# Altium schematic sheet TIDA-010954-Input.SchDoc
size 431 x 279 mm; Date: Not shown in title block; ApprovedBy: Not shown in title block; CheckedBy: Not shown in title block; Author: Not shown in title block; CompanyName: Not shown in title block; Engineer: Not shown in title block; Organization: Not shown in title block; Address1: Not shown in title block; Address2: Not shown in title block; Address3: Not shown in title block; Address4: Not shown in title block; DocumentNumber: 2; Revision: Use project parameter SCH_Rev; SheetNumber: 5; SheetTotal: 9; PageSetup: Record=PageOptions|CenterHorizontal=True|CenterVertical=True|PrintScale=1.00|XCorrection=1.00|YCorrection=1.00|PrintKind=0|BorderSize=5000000|LeftOffset=0|BottomOffset=0|Orientation=2|PaperLength=1000|PaperWidth=1000|Scale=100|PaperSource=15|PrintQuality=600|MediaType=1|DitherType=10|PaperKind=Letter|PrintScaleMode=1; CurrentTime: Not shown in title block; CurrentDate: Not shown in title block; Time: Not shown in title block; DocumentFullPathAndName: Not shown in title block; DocumentName: Not shown in title block; ModifiedDate: 1/25/2022; ImagePath: Not shown in title block
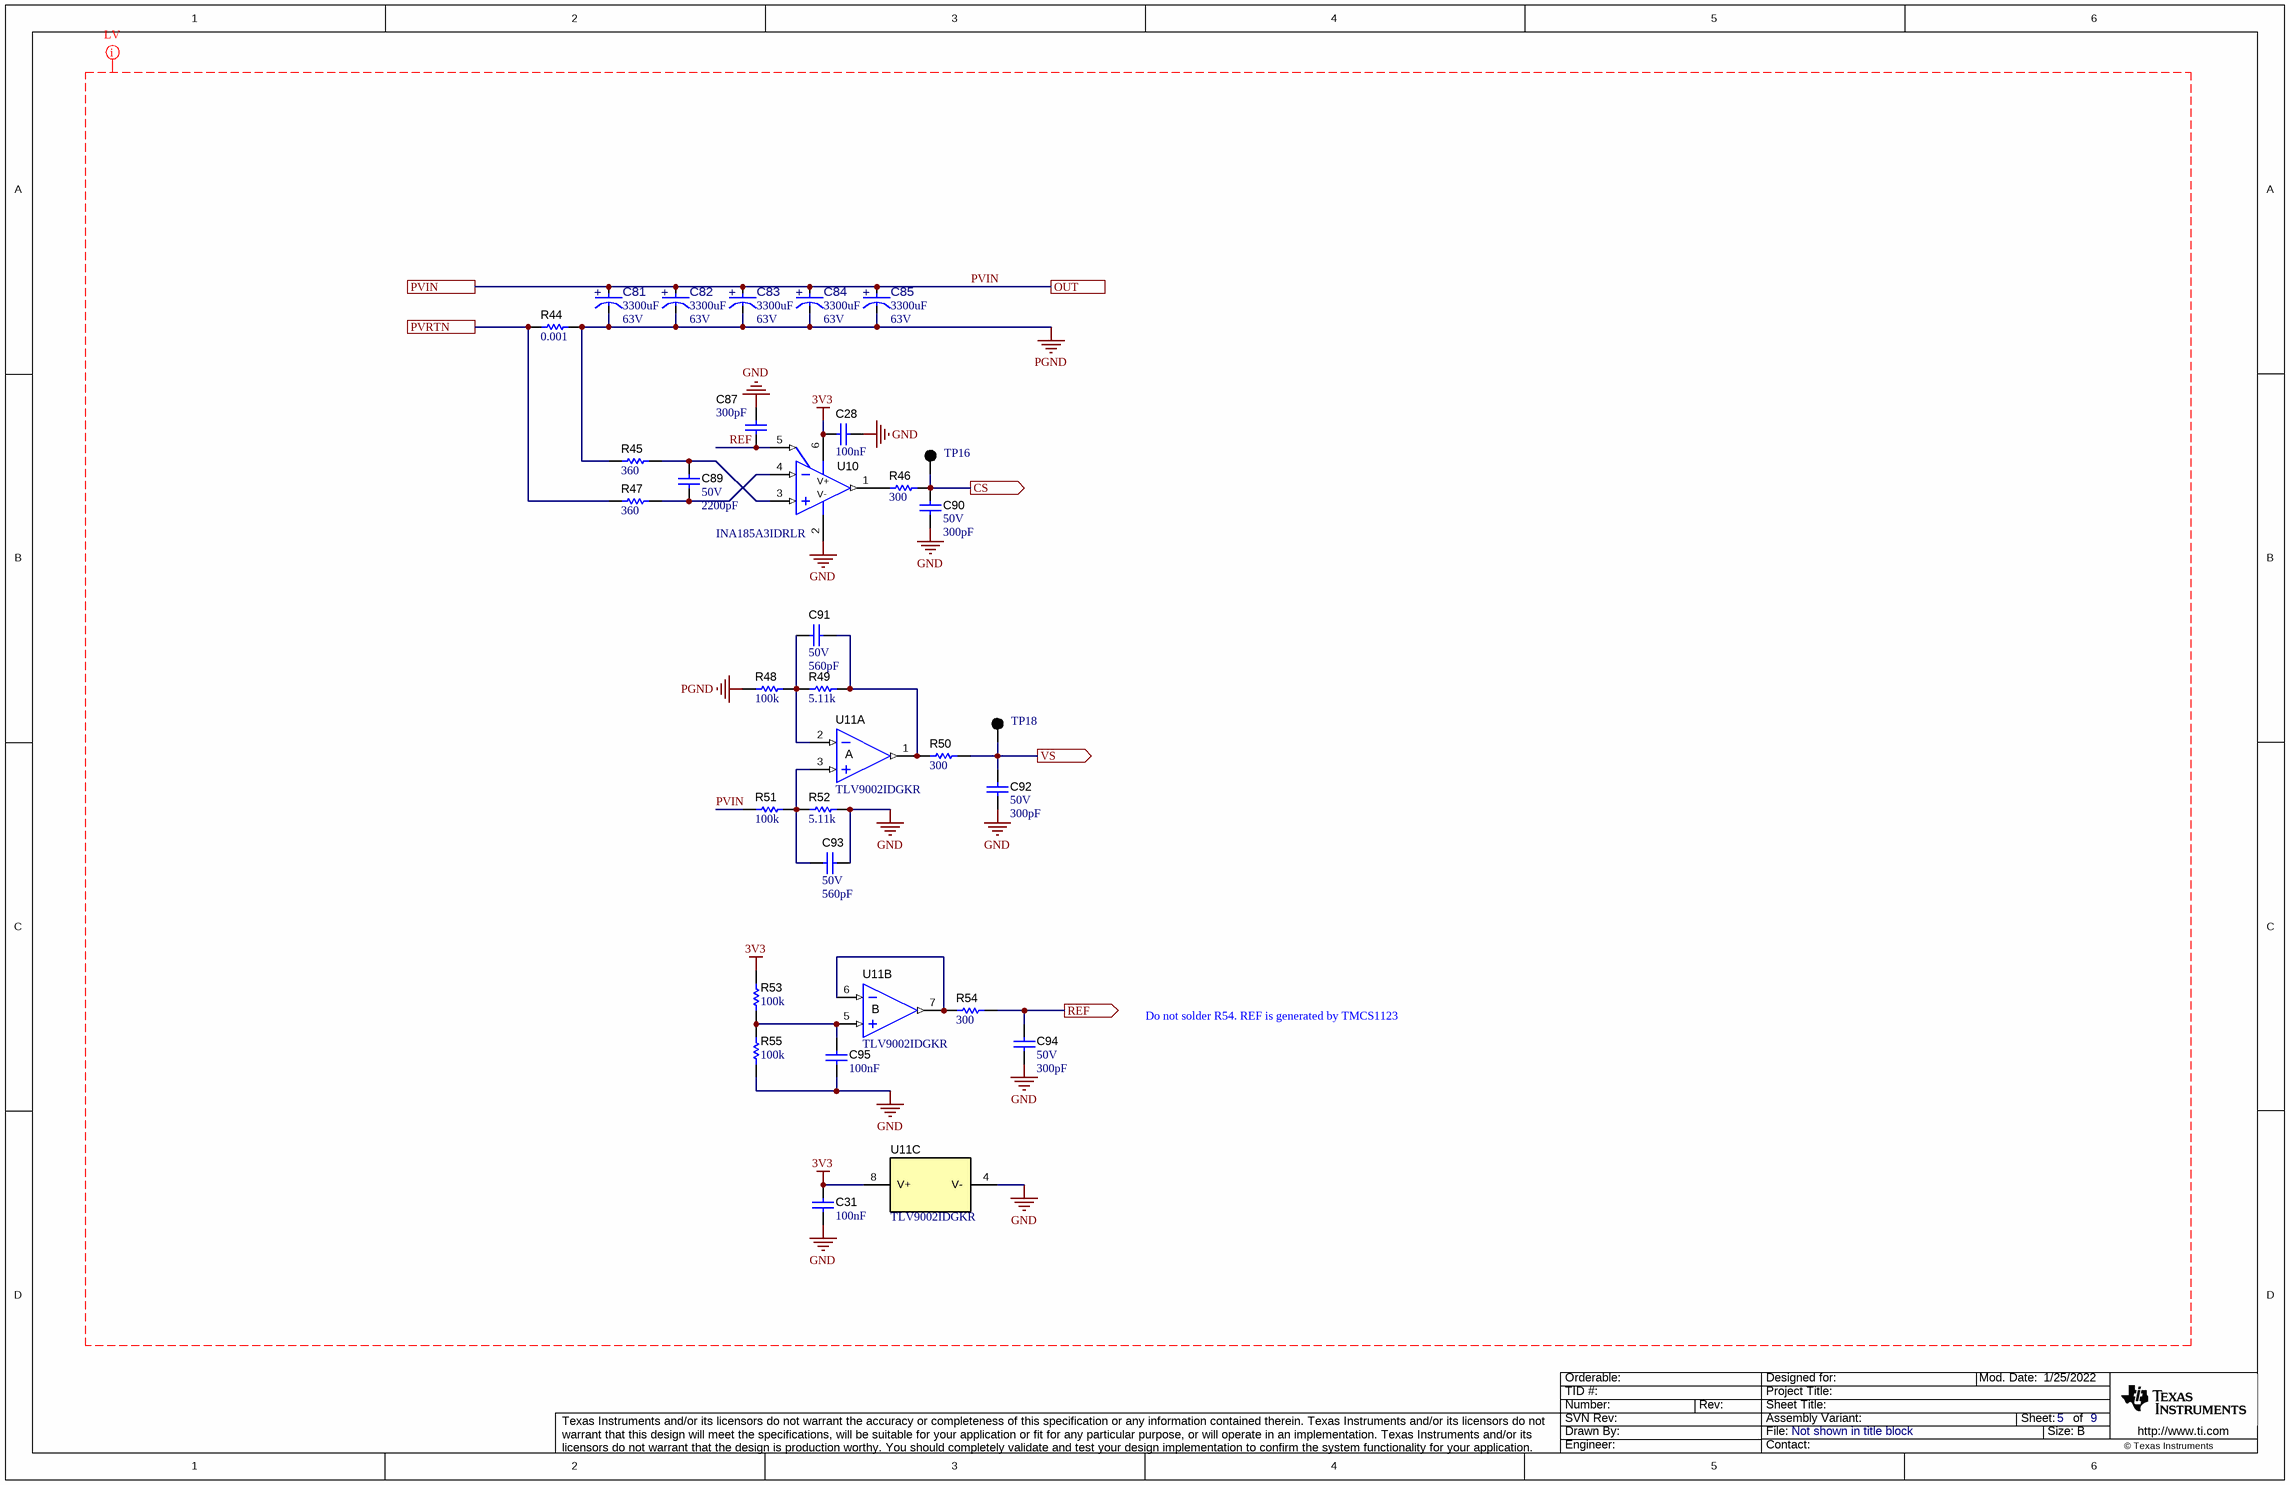
[diagram p0: TIDA-010954-Input.SchDoc]

## Parts
C28  Cap_F: 100nF  [0603]  (hidden comment: CGA3E2X7R1E104K080AA)
C31  Cap_F: 100nF  [0603]  (hidden comment: CGA3E2X7R1E104K080AA)
C81  ValueDisplayed: 3300uF  VDC_V: 63V  [FP-63ZLJ2700M18X40_RADIAL-MFG]  (hidden comment: 63ZLJ2700M18X40)
C82  ValueDisplayed: 3300uF  VDC_V: 63V  [FP-63ZLJ2700M18X40_RADIAL-MFG]  (hidden comment: 63ZLJ2700M18X40)
C83  ValueDisplayed: 3300uF  VDC_V: 63V  [FP-63ZLJ2700M18X40_RADIAL-MFG]  (hidden comment: 63ZLJ2700M18X40)
C84  ValueDisplayed: 3300uF  VDC_V: 63V  [FP-63ZLJ2700M18X40_RADIAL-MFG]  (hidden comment: 63ZLJ2700M18X40)
C85  ValueDisplayed: 3300uF  VDC_V: 63V  [FP-63ZLJ2700M18X40_RADIAL-MFG]  (hidden comment: 63ZLJ2700M18X40)
C87  ValueDisplayed: 300pF  [0603]  (hidden comment: GRM1885C1H301JA01D)
C89  VDC_V: 50V  ValueDisplayed: 2200pF  [0603]  (hidden comment: GRM1885C1H222JA01D)
C90  VDC_V: 50V  ValueDisplayed: 300pF  [0603]  (hidden comment: GRM1885C1H301JA01D)
C91  VDC_V: 50V  ValueDisplayed: 560pF  [0603]  (hidden comment: GRM1885C1H561JA01D)
C92  VDC_V: 50V  ValueDisplayed: 300pF  [0603]  (hidden comment: GRM1885C1H301JA01D)
C93  VDC_V: 50V  ValueDisplayed: 560pF  [0603]  (hidden comment: GRM1885C1H561JA01D)
C94  VDC_V: 50V  ValueDisplayed: 300pF  [0603]  (hidden comment: GRM1885C1H301JA01D)
C95  Cap_F: 100nF  [0603]  (hidden comment: CGA3E2X7R1E104K080AA)
R44  ValueDisplayed: 0.001  [1206]  (hidden comment: CRF1206-FZ-R001ELF)
R45  ValueDisplayed: 360  [0603]  (hidden comment: RC0603JR-07360RL)
R46  ValueDisplayed: 300  [0603]  (hidden comment: RC0603FR-07300RL)
R47  ValueDisplayed: 360  [0603]  (hidden comment: RC0603JR-07360RL)
R48  ValueDisplayed: 100k  [0603]  (hidden comment: RT0603BRD07100KL)
R49  ValueDisplayed: 5.11k  [0603]  (hidden comment: RT0603BRD075K11L)
R50  ValueDisplayed: 300  [0603]  (hidden comment: RC0603FR-07300RL)
R51  ValueDisplayed: 100k  [0805_HV]  (hidden comment: RT0805BRD07100KL)
R52  ValueDisplayed: 5.11k  [0603]  (hidden comment: RT0603BRD075K11L)
R53  ValueDisplayed: 100k  [0603]  (hidden comment: RT0603BRD07100KL)
R54  ValueDisplayed: 300  [0603]  (hidden comment: RC0603FR-07300RL)
R55  ValueDisplayed: 100k  [0603]  (hidden comment: RT0603BRD07100KL)
TP16  5011  [Keystone5011]  (value not drawn)
TP18  5011  [Keystone5011]  (value not drawn)
U10  INA185A3IDRLR  [DRL0006A]
U11  TLV9002IDGKR  [DGK0008A_N]  (parts A,B,C of 3)

## Ports
CS (out), OUT, PVIN, PVRTN, REF (out), VS (out)

## Nets
3V3: C28.1 C31.2 R53.1 U10.6(V+) U11.8(V+)
GND: C28.2 C31.1 C87.2 C90.2 C92.2 C93.1 C94.2 C95.1 R52.2 R55.2 U10.2(V-) U11.4(V-)
PGND: C81.1(CATHODE) C82.1(CATHODE) C83.1(CATHODE) C84.1(CATHODE) C85.1(CATHODE) R44.2 R45.1 R48.1
CS: C90.1 R46.1 TP16.1 ; port CS
PVIN: C81.2(ANODE) C82.2(ANODE) C83.2(ANODE) C84.2(ANODE) C85.2(ANODE) R51.1 ; port PVIN, port OUT
PVRTN: R44.1 R47.1 ; port PVRTN
REF: C94.1 R54.1 ; port REF
REF: C87.1 U10.5(REF)  [a separate net that carries the same name]
VS: C92.1 R50.1 TP18.1 ; port VS
NetC89_1: C89.1 R45.2 U10.3(IN+)
NetC89_2: C89.2 R47.2 U10.4(IN-)
NetC91_1: C91.1 R49.2 R50.2 U11.1(OUT)
NetC91_2: C91.2 R48.2 R49.1 U11.2(IN-)
NetC93_2: C93.2 R51.2 R52.1 U11.3(IN+)
NetC95_2: C95.2 R53.2 R55.1 U11.5(IN+)
NetR46_2: R46.2 U10.1(OUT)
NetR54_2: R54.2 U11.6(IN-) U11.7(OUT)

## Layout directives
net class LV: 3V3, GND, PGND, PVIN, REF

## Notes on the sheet
- Do not solder R54. REF is generated by TMCS1123
- Drawn By:
- SVN Rev:
- Number:
- TID #:
- Orderable:
- Rev:
- Sheet Title:
- File:
- Project Title:
- Designed for:
- Assembly Variant:
- Mod. Date:
- Sheet:
- Size:
- of
- B
- http://www.ti.com
- Texas Instruments and/or its licensors do not warrant the accuracy or completeness of this specification or any information contained therein. Texas Instruments and/or its licensors do not warrant that this design will meet the specifications, will be suitable for your application or fit for any particular purpose, or will operate in an implementation. Texas Instruments and/or its licensors do not warrant that the design is production worthy. You should completely validate and test your design implementation to confirm the system functionality for your application.
- Engineer:
- Contact:
- © Texas Instruments
- (in symbol CMP-0073533-3, part A) A
- (in symbol CMP-0073533-3, part B) B
- (in symbol CMP-0122849-1) +

## Library data of the parts
C28 C31 C95 = CMP-0007077-5: CAP, CERM, 0.1 uF, 25 V, +/- 10%, X7R, AEC-Q200 Grade 1, 0603; Manufacturer: TDK; TaMin_C: -55°C; Polarized: N; SizeAreaWB_mm2: 4.68; Value1: Unknown; U/M: EA; Value: 0.1uF; TaMax_C: 125°C; SizeZ_mm: 1; SizeX_mm: 1.6; SizeY_mm: 0.8; Value2: 25V; SizeArea_mm2: 1.28; AEC Qualified: Y; AEC Category: Q200; Supplier Part Number 2: 79Y4100; Publisher: Texas Instruments; Supplier 2: Newark; Supplier Part Number 3: 810-CGA3E2X7R1E104K; TempCo: X7R; Supplier 3: Mouser; Published: 2008-06-19; RoHS: Y; MountType: SMT; Supplier 1: Digi-Key; PackageReference: 0603; Tolerance_%: 10%; Cap_Case: 0603; CompType: Capacitor; LatestRevisionDate: 2017-03-09; PartNumber: CGA3E2X7R1E104K080AA; VDC_V: 25V; ComponentLink1Description: Datasheet link; AEC Grade: 1; Supplier Part Number 1: 445-5667-1-ND; Technology: Ceramic; ValueDisplayed: 0.1uF; ComponentLink1URL: https://product.tdk.com/info/en/documents/chara_sheet/CGA3E2X7R1E104K080AA.pdf
C81-C85 = CMP-0122849-1: 2700 µF 63 V Aluminum Electrolytic Capacitors Radial, Can 10000 Hrs @ 105°C; Manufacturer: Rubycon; Part Number: 63PK3300MEFC18X40; AEC Qualified: No; Cap_F: 2.7mF; IRMS_A: 4.3A; SizeZ_mm: 42mm; Tolerance_%: 20%; Dissipation Factor: 9%; Leakage Current: 1701uA; Life: 10000Hours; Value: 2.7mF; PackageReference: RADIAL; PartNumber: 63ZLJ2700M18X40; RoHS: TRUE; Supplier 1: Digikey; Supplier 2: Mouser; Supplier Part Number 1: 1189-4111-ND; Supplier Part Number 2: 232-63ZLJ2700M18X40; datasheet: https://www.rubycon.co.jp/wp-content/uploads/catalog-aluminum/ZLJ.pdf; Datasheet Path: datasheets/Cap-63ZLJ2700M18X40.pdf; Digikey Description: CAP ALUM 2700UF 20% 63V RADIAL; Digikey Part Number: 1189-4111-ND; helpURL: https://upverter.com/upn/revision/aed06e7c5360b1c1/; Lead Free: Yes; Mouser Part Number: 232-63ZLJ2700M18X40; Operating Temperature Range: -40°C to +105°C; ComponentLink1Description: Datasheet; ComponentLink1URL: https://www.rubycon.co.jp/wp-content/uploads/catalog-aluminum/ZLJ.pdf
C87 = CMP-0007206-4: CAP, CERM, 300 pF, 50 V, +/- 5%, C0G/NP0, 0603; Manufacturer: MuRata; TaMin_C: -55°C; Polarized: N; SizeAreaWB_mm2: 4.68; Value1: Unknown; U/M: EA; Value: 300pF; TaMax_C: 125°C; SizeZ_mm: 1; SizeX_mm: 1.6; SizeY_mm: 0.8; Value2: 50V; SizeArea_mm2: 1.28; AEC Category: Q200; Supplier Part Number 2: 81-GRM185C1H301JA01D; Publisher: Texas Instruments; Supplier 2: Mouser; TempCo: C0G/NP0; Published: 2008-06-19; RoHS: Y; MountType: SMT; Supplier 1: Digi-Key; PackageReference: 0603; Tolerance_%: 5%; Cap_Case: 0603; CompType: Capacitor; LatestRevisionDate: 2017-03-09; PartNumber: GRM1885C1H301JA01D; AEC Qualified: ?; Cap_F: 300pF; VDC_V: 50V; ComponentLink1Description: Datasheet link; Supplier Part Number 1: 490-1438-1-ND; Technology: Ceramic; ComponentLink1URL: http://search.murata.co.jp/Ceramy/PnsearchViewAction.do?HnOFG=ON&HnNFG=ON&SEL_CNT=50&sLang=en&sKey=GRM1885C1H301JA01D&x=9&y=9&search=startwith
C89 = CMP-0007198-4: CAP, CERM, 2200 pF, 50 V, +/- 5%, C0G/NP0, 0603; Manufacturer: MuRata; TaMin_C: -55°C; Polarized: N; SizeAreaWB_mm2: 4.68; Value1: Unknown; U/M: EA; Value: 2200pF; TaMax_C: 125°C; SizeZ_mm: 1; SizeX_mm: 1.6; SizeY_mm: 0.8; SizeArea_mm2: 1.28; Cap_F: 2.2nF; AEC Category: Q200; Supplier Part Number 2: 81-GRM1885C1H222JA01; Publisher: Texas Instruments; Supplier 2: Mouser; Supplier Part Number 3: 8819947; TempCo: C0G/NP0; Supplier 3: Farnell; Published: 2008-06-19; RoHS: Y; MountType: SMT; Supplier 1: Digi-Key; PackageReference: 0603; Tolerance_%: 5%; Cap_Case: 0603; Value2: 50V; CompType: Capacitor; LatestRevisionDate: 2017-03-09; PartNumber: GRM1885C1H222JA01D; AEC Qualified: ?; ComponentLink1Description: Datasheet link; Supplier Part Number 1: 490-1459-1-ND; Technology: Ceramic; ComponentLink1URL: http://search.murata.co.jp/Ceramy/PnsearchViewAction.do?HnOFG=ON&HnNFG=ON&SEL_CNT=50&sLang=en&sKey=GRM1885C1H222JA01D&x=9&y=9&search=startwith
C90 C92 C94 = CMP-0007206-4: CAP, CERM, 300 pF, 50 V, +/- 5%, C0G/NP0, 0603; Manufacturer: MuRata; TaMin_C: -55°C; Polarized: N; SizeAreaWB_mm2: 4.68; Value1: Unknown; U/M: EA; Value: 300pF; TaMax_C: 125°C; SizeZ_mm: 1; SizeX_mm: 1.6; SizeY_mm: 0.8; SizeArea_mm2: 1.28; AEC Category: Q200; Supplier Part Number 2: 81-GRM185C1H301JA01D; Publisher: Texas Instruments; Supplier 2: Mouser; TempCo: C0G/NP0; Published: 2008-06-19; RoHS: Y; MountType: SMT; Supplier 1: Digi-Key; PackageReference: 0603; Tolerance_%: 5%; Cap_Case: 0603; Value2: 50V; CompType: Capacitor; LatestRevisionDate: 2017-03-09; PartNumber: GRM1885C1H301JA01D; AEC Qualified: ?; Cap_F: 300pF; ComponentLink1Description: Datasheet link; Supplier Part Number 1: 490-1438-1-ND; Technology: Ceramic; ComponentLink1URL: http://search.murata.co.jp/Ceramy/PnsearchViewAction.do?HnOFG=ON&HnNFG=ON&SEL_CNT=50&sLang=en&sKey=GRM1885C1H301JA01D&x=9&y=9&search=startwith
C91 C93 = CMP-0007225-4: CAP, CERM, 560 pF, 50 V, +/- 5%, C0G/NP0, 0603; Manufacturer: MuRata; TaMin_C: -55°C; Polarized: N; SizeAreaWB_mm2: 4.68; Value1: Unknown; U/M: EA; Value: 560pF; TaMax_C: 125°C; SizeZ_mm: 1; SizeX_mm: 1.6; SizeY_mm: 0.8; SizeArea_mm2: 1.28; AEC Category: Q200; Supplier Part Number 2: 81-GRM39C561J50; Publisher: Texas Instruments; Supplier 2: Mouser; Supplier Part Number 3: 1828912; TempCo: C0G/NP0; Supplier 3: Farnell; Published: 2008-06-19; RoHS: Y; MountType: SMT; Supplier 1: Digi-Key; PackageReference: 0603; Tolerance_%: 5%; Cap_Case: 0603; Value2: 50V; CompType: Capacitor; LatestRevisionDate: 2017-03-09; PartNumber: GRM1885C1H561JA01D; AEC Qualified: ?; Cap_F: 560pF; ComponentLink1Description: Datasheet link; Supplier Part Number 1: 490-1445-1-ND; Technology: Ceramic; ComponentLink1URL: http://search.murata.co.jp/Ceramy/PnsearchViewAction.do?HnOFG=ON&HnNFG=ON&SEL_CNT=50&sLang=en&sKey=GRM1885C1H561JA01D&x=9&y=9&search=startwith
R44 = CMP-0078821-1: RES, 0.001, 1%, 1 W, AEC-Q200 Grade 0, 1206; Manufacturer: Bourns; Value_Code: 1L000; SizeArea_mm2: 5.12; AEC Qualified: Y; AEC Category: Q200; Res_ohm: 1m; Value: 0.001; SizeZ_mm: 1.35; EIA_Code: E96; TempCo: 50 ppm/C; AEC Grade: 0; SizeY_mm: 1.6; Power_W: 1W; SizeX_mm: 3.2; ComponentLink1Description: Datasheet link; RoHS: Y; Tolerance_%: 1%; PackageReference: 1206; Technology: Metal Film; PartNumber: CRF1206-FZ-R001ELF; Value2: 1W; ComponentLink1URL: http://www.bourns.com/docs/Product-Datasheets/crf.pdf; Value1: 1%; CompType: Resistor; MountType: SMT
R45 R47 = CMP-0025914-5: RES, 360, 5%, 0.1 W, 0603; Manufacturer: Yageo; Power_W: 100mW; TempCo: 100 ppm/C; Value_Code: 360R; Value: 360; EIA_Code: E24; SizeX_mm: 1.6; SizeY_mm: 0.8; SizeZ_mm: 1; Value2: 0.1W; SizeArea_mm2: 1.28; AEC Qualified: N; VDC_V: 75V; AEC Category: Q200; SizeAreaWB_mm2: 4.68; Supplier Part Number 2: 603-RC0603JR-07360RL; Supplier 2: Mouser; RoHS: Y; Value1: 5%; MountType: SMT; Supplier 1: Digi-Key; PackageReference: 0603; Tolerance_%: 5%; Res_ohm: 360; CompType: Resistor; PartNumber: RC0603JR-07360RL; ComponentLink1Description: Datasheet link; Supplier Part Number 1: 311-360GRCT-ND; Technology: Thick Film; ComponentLink1URL: http://www.yageo.com/pdf/Pu-RC0603_51_PbFree_L_2.pdf; AEC Grade: N/A
R46 R50 R54 = CMP-0023013-5: RES, 300, 1%, 0.1 W, 0603; Manufacturer: Yageo; Power_W: 100mW; TempCo: 100 ppm/C; Value_Code: 300R; Value: 300; SizeX_mm: 1.6; SizeY_mm: 0.8; SizeZ_mm: 1; Value2: 0.1W; SizeArea_mm2: 1.28; AEC Qualified: N; VDC_V: 75V; AEC Category: Q200; SizeAreaWB_mm2: 4.68; Supplier Part Number 2: 603-RC0603FR-07300RL; Supplier 2: Mouser; Supplier Part Number 3: 1799340; Supplier 3: Farnell; RoHS: Y; Value1: 1%; MountType: SMT; Supplier 1: Digi-Key; PackageReference: 0603; Tolerance_%: 1%; Res_ohm: 300; CompType: Resistor; PartNumber: RC0603FR-07300RL; ComponentLink1Description: Datasheet link; Supplier Part Number 1: 311-300HRCT-ND; Technology: Thick Film; ComponentLink1URL: http://www.yageo.com/pdf/Pu-RC0603_51_PbFree_L_2.pdf; AEC Grade: N/A
R48 R53 R55 = CMP-0023630-3: RES, 100 k, 0.1%, 0.1 W, 0603; Manufacturer: Yageo America; Power_W: 100mW; TempCo: 25 ppm/C; U/M: EA; Value: 100k; EIA_Code: E192; SizeX_mm: 1.6; SizeY_mm: 0.8; SizeZ_mm: 1; Value2: 0.1W; SizeArea_mm2: 1.28; VDC_V: 75V; AEC Category: Q200; Publisher: Texas Instruments; Published: 2008-06-26; Value_Code: 100k; RoHS: Y; Value1: 0.1%; MountType: SMT; Supplier 1: Mouser; PackageReference: 0603; Tolerance_%: 0.1%; Res_ohm: 100k; CompType: Resistor; LatestRevisionDate: 2017-03-09; PartNumber: RT0603BRD07100KL; AEC Qualified: ?; ComponentLink1Description: Datasheet link; Supplier Part Number 1: 603-RT0603BRD07100KL; Technology: Thin Film; ComponentLink1URL: http://www.yageo.com/pdf/PYu-RT_1-to-0.05_RoHS_L_3.pdf
R49 R52 = CMP-0024366-2: RES, 5.11 k, 0.1%, 0.1 W, 0603; Manufacturer: Yageo America; Power_W: 100mW; TempCo: 25 ppm/C; Value_Code: 5k11; U/M: EA; Value: 5.11k; EIA_Code: E192; SizeX_mm: 1.6; SizeY_mm: 0.8; SizeZ_mm: 1; Value2: 0.1W; SizeArea_mm2: 1.28; VDC_V: 75V; AEC Category: Q200; ComponentLink1URL: http://www.yageo.com/pdf/PYu-RT_1-to-0.05_RoHS_L_3.pdf; Publisher: Texas Instruments; Published: 2008-06-26; RoHS: Y; Value1: 0.1%; MountType: SMT; PackageReference: 0603; Tolerance_%: 0.1%; Res_ohm: 5.11k; CompType: Resistor; LatestRevisionDate: 2017-03-09; PartNumber: RT0603BRD075K11L; AEC Qualified: ?; ComponentLink1Description: Datasheet link; Technology: Thin Film
R51 = CMP-0019441-2: RES, 100 k, 0.1%, 0.125 W, 0805; Manufacturer: Yageo America; Power_W: 125mW; TempCo: 25 ppm/C; U/M: EA; Value: 100k; EIA_Code: E192; SizeX_mm: 2; SizeY_mm: 1.25; SizeZ_mm: 1.45; Value2: 0.125W; SizeArea_mm2: 2.5; VDC_V: 150V; AEC Category: Q200; Publisher: Texas Instruments; Published: 2008-06-26; Value_Code: 100k; RoHS: Y; Value1: 0.1%; MountType: SMT; PackageReference: 0805; Tolerance_%: 0.1%; Res_ohm: 100k; CompType: Resistor; LatestRevisionDate: 2017-03-09; PartNumber: RT0805BRD07100KL; AEC Qualified: ?; ComponentLink1Description: Datasheet link; Technology: Thin Film; ComponentLink1URL: http://www.yageo.com/pdf/PYu-RT_1-to-0.05_RoHS_L_3.pdf
TP16 TP18 = CMP-0055148-2: Test Point, Multipurpose, Black, TH; Manufacturer: Keystone Electronics; CNHeader: FALSE; ContactFinish: Silver; Green_REACh: Passed; Green_Lifecycle: Active; CT: TRUE; ComponentLink1Description: Datasheet URL; Supplier 1: Digi-Key; MountType: TH; Supplier 2: Mouser; LatestRevisionDate: 26/05/2017; Publisher: Texas Instruments; PartNumber: 5011; Color: Black; ComponentLink1URL: http://www.keyelco.com/userAssets/file/M60-2p60.pdf; Green_EU RoHS-2: Incomplete; Supplier Part Number 1: 36-5011-ND; Supplier Part Number 2: 534-5011; Green_EU RoHS: Passed; RoHS: Y; PackageReference: Black Multipurpose Testpoint; CompType: Test Point
U10 = CMP-0085240-1: Bidirectional, Precision Low- and High-Side Voltage Output, Current-Sense Amplifier, DRL0006A (SOT-5X3-6); Alternate Manufacturer: Texas Instruments; Alternate PartNumber: INA185A3IDRLT; SizeAreaWB_mm2: 6.76; SizeY_mm: 1.6; CompType: IC; SizeZ_mm: 0.6; AEC Category: Q200; SizeArea_mm2: 2.56; AEC Qualified: N; ComponentLink2URL: http://www.ti.com/product/ina185; MountType: SMT; ComponentLink1URL: http://www.ti.com/lit/ds/symlink/ina185.pdf; ComponentLink3Description: Online Datasheet; ComponentLink1Description: Datasheet Link; ComponentLink2Description: Product Folder; Manufacturer: Texas Instruments; PackageReference: DRL0006A; PartNumber: INA185A3IDRLR; ComponentLink3URL: http://www.ti.com/product/ina185/datasheet; SizeX_mm: 1.6; PackageDescription: SOT-5X3-6
U11 = CMP-0073533-3: Alternate PartNumber: TLV2333IDGKT; Alternate Manufacturer: Texas Instruments; SizeAreaWB_mm2: 23.6; SizeZ_mm: 1.1; SizeX_mm: 4.9; SizeY_mm: 3; SizeArea_mm2: 14.7; CompType: IC; AEC Category: Q200; AEC Qualified: N; ComponentLink1URL: http://www.ti.com/lit/ds/symlink/tlv2333.pdf; PackageDescription: VSSOP-8; RoHS: Y; MountType: SMT; Manufacturer: Texas Instruments; PackageReference: DGK0008A; PartNumber: TLV9002IDGKR; ComponentLink1Description: Datasheet Link; ComponentLink2Description: Product Folder; ComponentLink2URL: http://www.ti.com/product/tlv2333; ComponentLink3Description: Online Datasheet; ComponentLink3URL: http://www.ti.com/product/tlv2333/datasheet; Code_JEDEC: MO-187-AA